# Altium project Proyecto Módulo Gasolina.PrjPCB
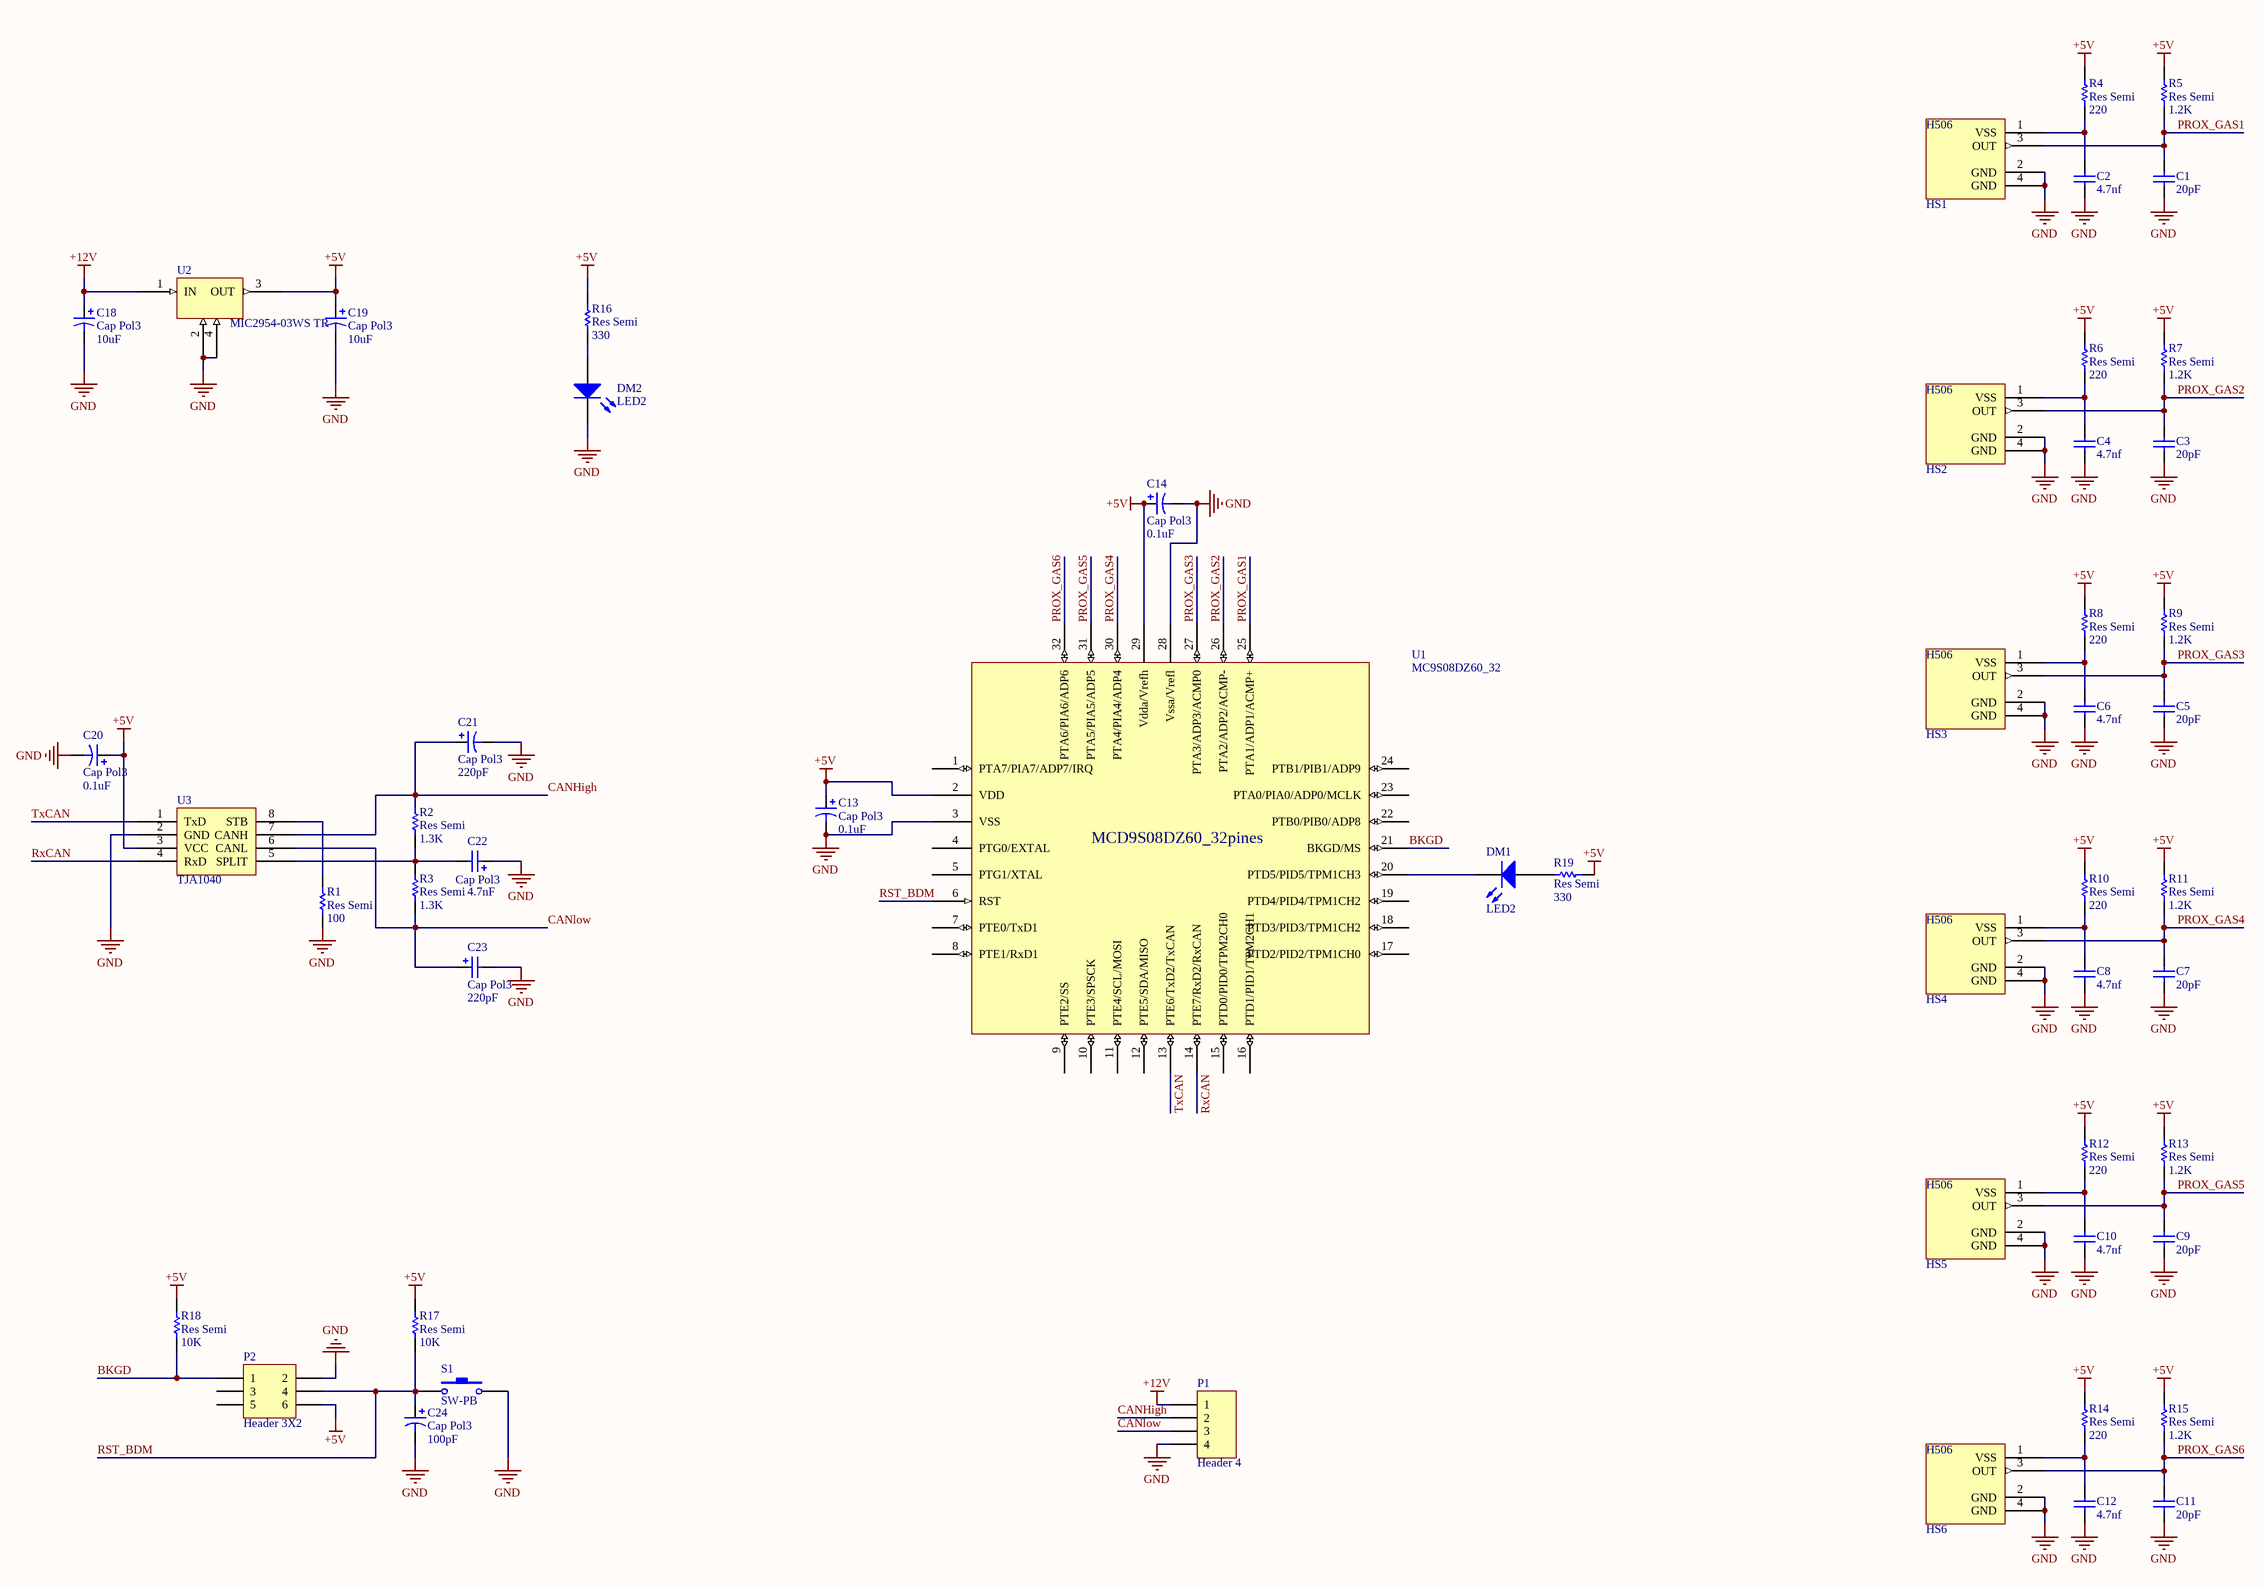
[diagram p0: Esquemático Módulo Gasolina.SchDoc]
1 sheet, 54 parts. Net scope: global (net labels, ports and power ports of the same name join across sheets).
Board file: PCB Módulo Gasolina.PcbDoc

## Sheet Esquemático Módulo Gasolina.SchDoc
size A2

### Parts
C1  value 20pF  [C0805]  (hidden comment: Cap Semi)
C2  value 4.7nf  [C0805]  (hidden comment: Cap Semi)
C3  value 20pF  [C0805]  (hidden comment: Cap Semi)
C4  value 4.7nf  [C0805]  (hidden comment: Cap Semi)
C5  value 20pF  [C0805]  (hidden comment: Cap Semi)
C6  value 4.7nf  [C0805]  (hidden comment: Cap Semi)
C7  value 20pF  [C0805]  (hidden comment: Cap Semi)
C8  value 4.7nf  [C0805]  (hidden comment: Cap Semi)
C9  value 20pF  [C0805]  (hidden comment: Cap Semi)
C10  value 4.7nf  [C0805]  (hidden comment: Cap Semi)
C11  value 20pF  [C0805]  (hidden comment: Cap Semi)
C12  value 4.7nf  [C0805]  (hidden comment: Cap Semi)
C13  Cap Pol3  value 0.1uF  [C0805]
C14  Cap Pol3  value 0.1uF  [C0805]
C18  Cap Pol3  value 10uF  [C0805]
C19  Cap Pol3  value 10uF  [C0805]
C20  Cap Pol3  value 0.1uF  [C0805]
C21  Cap Pol3  value 220pF  [C0805]
C22  Cap Pol3  value 4.7nF  [C0805]
C23  Cap Pol3  value 220pF  [C0805]
C24  Cap Pol3  value 100pF  [C0805]
DM1  LED2  [LED SMD]
DM2  LED2  [SMD pads LED]
HS1  Component_1  [SOT89M]  (value not drawn)
HS2  Component_1  [SOT89M]  (value not drawn)
HS3  Component_1  [SOT89M]  (value not drawn)
HS4  Component_1  [SOT89M]  (value not drawn)
HS5  Component_1  [SOT89M]  (value not drawn)
HS6  Component_1  [SOT89M]  (value not drawn)
P1  Header 4  [Conector Cables 4]
P2  Header 3X2  [HDR2X3 mod]
R1  Res Semi  value 100  [2012[0805]]
R2  Res Semi  value 1.3K  [2012[0805]]
R3  Res Semi  value 1.3K  [2012[0805]]
R4  Res Semi  value 220  [2012[0805]]
R5  Res Semi  value 1.2K  [2012[0805]]
R6  Res Semi  value 220  [2012[0805]]
R7  Res Semi  value 1.2K  [2012[0805]]
R8  Res Semi  value 220  [2012[0805]]
R9  Res Semi  value 1.2K  [2012[0805]]
R10  Res Semi  value 220  [2012[0805]]
R11  Res Semi  value 1.2K  [2012[0805]]
R12  Res Semi  value 220  [2012[0805]]
R13  Res Semi  value 1.2K  [2012[0805]]
R14  Res Semi  value 220  [2012[0805]]
R15  Res Semi  value 1.2K  [2012[0805]]
R16  Res Semi  value 330  [2012[0805]]
R17  Res Semi  value 10K  [2012[0805]]
R18  Res Semi  value 10K  [2012[0805]]
R19  Res Semi  value 330  [2012[0805]]
S1  SW-PB  [Boton]
U1  MC9S08DZ60_32  [873-01_M]
U2  MIC2954-03WS TR  [SOT223-4M]
U3  TJA1040  [SOT96-1_L]

### Nets
+5V: C13.1 C14.1 C19.1 C20.1 P2.6 R4.2 R5.2 R6.2 R7.2 R8.2 R9.2 R10.2 R11.2 R12.2 R13.2 R14.2 R15.2 R16.1 R17.2 R18.2 R19.2 U1.2(VDD) U1.29(Vdda/Vrefh) U2.3(OUT) U3.3(VCC)
+12V: C18.1 P1.1 U2.1(IN)
GND: C1.1 C2.1 C3.1 C4.1 C5.1 C6.1 C7.1 C8.1 C9.1 C10.1 C11.1 C12.1 C13.2 C14.2 C18.2 C19.2 C20.2 C21.2 C22.1 C23.2 C24.2 DM2.2(K) HS1.2(GND) HS1.4(GND) HS2.2(GND) HS2.4(GND) HS3.2(GND) HS3.4(GND) HS4.2(GND) HS4.4(GND) HS5.2(GND) HS5.4(GND) HS6.2(GND) HS6.4(GND) P1.4 P2.2 R1.1 S1.2 U1.3(VSS) U1.28(Vssa/Vrefl) U2.2 U2.4 U3.2(GND)
BKGD: P2.1 R18.1 U1.21(BKGD/MS)
CANHigh: C21.1 P1.2 R2.2 U3.7(CANH)
CANlow: C23.1 P1.3 R3.1 U3.6(CANL)
PROX_GAS1: C1.2 HS1.3(OUT) R5.1 U1.25(PTA1/ADP1/ACMP+)
PROX_GAS2: C3.2 HS2.3(OUT) R7.1 U1.26(PTA2/ADP2/ACMP-)
PROX_GAS3: C5.2 HS3.3(OUT) R9.1 U1.27(PTA3/ADP3/ACMP0)
PROX_GAS4: C7.2 HS4.3(OUT) R11.1 U1.30(PTA4/PIA4/ADP4)
PROX_GAS5: C9.2 HS5.3(OUT) R13.1 U1.31(PTA5/PIA5/ADP5)
PROX_GAS6: C11.2 HS6.3(OUT) R15.1 U1.32(PTA6/PIA6/ADP6)
RST_BDM: C24.1 P2.4 R17.1 S1.1 U1.6(RST)
RxCAN: U1.14(PTE7/RxD2/RxCAN) U3.4(RxD)
TxCAN: U1.13(PTE6/TxD2/TxCAN) U3.1(TxD)
NetC2_2: C2.2 HS1.1(VSS) R4.1
NetC4_2: C4.2 HS2.1(VSS) R6.1
NetC6_2: C6.2 HS3.1(VSS) R8.1
NetC8_2: C8.2 HS4.1(VSS) R10.1
NetC10_2: C10.2 HS5.1(VSS) R12.1
NetC12_2: C12.2 HS6.1(VSS) R14.1
NetC22_2: C22.2 R2.1 R3.2 U3.5(SPLIT)
NetDM1_1: DM1.1(A) R19.1
NetDM1_2: DM1.2(K) U1.20(PTD5/PID5/TPM1CH3)
NetDM2_1: DM2.1(A) R16.2
NetR1_2: R1.2 U3.8(STB)

Not connected (* = marked no-connect by the designer): P2 3 5; U1 1(PTA7/PIA7/ADP7/IRQ) 4(PTG0/EXTAL) 5(PTG1/XTAL) 7(PTE0/TxD1) 8(PTE1/RxD1) 9(PTE2/SS) 10(PTE3/SPSCK) 11(PTE4/SCL/MOSI) 12(PTE5/SDA/MISO) 15(PTD0/PID0/TPM2CH0) 16(PTD1/PID1/TPM2CH1) 17(PTD2/PID2/TPM1CH0) 18(PTD3/PID3/TPM1CH2) 19(PTD4/PID4/TPM1CH2) 22(PTB0/PIB0/ADP8) 23(PTA0/PIA0/ADP0/MCLK) 24(PTB1/PIB1/ADP9)

### Notes on the sheet
- (in symbol Component_1) H506
- (in symbol MC9S08DZ60_32) MCD9S08DZ60_32pines

### Library data of the parts
C1-C12 = Cap Semi: Capacitor (Semiconductor SIM Model); Published: 8-Jun-2000; LatestRevisionDate: 29-May-2009; LatestRevisionNote: IPC-7351 Footprint Added.; PackageReference: C1206; Publisher: Altium Limited; PackageDescription: Chip Capacitor
C13 C14 C18-C24 = Cap Pol3: Polarized Capacitor (Surface Mount); Published: 8-Jun-2000; LatestRevisionDate: 17-Jul-2002; LatestRevisionNote: Re-released for DXP Platform.; PackageReference: C0805; Publisher: Altium Limited
DM1 DM2 = LED2: Typical RED, GREEN, YELLOW, AMBER GaAs LED; Published: 8-Jun-2000; LatestRevisionDate: 17-Jul-2002; LatestRevisionNote: Re-released for DXP Platform.; PackageDocument: Feb-2002; PackageReference: 3.2X1.6X1.1; Publisher: Altium Limited
P1 = Header 4: Header, 4-Pin; LatestRevisionDate: 17-Jul-2002; LatestRevisionNote: Re-released for DXP Platform.; Publisher: Altium Limited
P2 = Header 3X2: Header, 3-Pin, Dual row; LatestRevisionDate: 17-Jul-2002; LatestRevisionNote: Re-released for DXP Platform.; Publisher: Altium Limited
R1-R19 = Res Semi: Semiconductor Resistor; Published: 8-Jun-2000; LatestRevisionDate: 17-Jul-2002; LatestRevisionNote: Re-released for DXP Platform.; PackageReference: AXIAL-0.5; Publisher: Altium Limited
S1 = SW-PB: Switch; Published: 24-Mar-1999; LatestRevisionDate: 17-Jul-2002; LatestRevisionNote: Re-released for DXP Platform.; PackageReference: SPST-2; Publisher: Altium Limited
U2 = Component_1_1